# EAGLE design midisync (EAGLE 5.08)
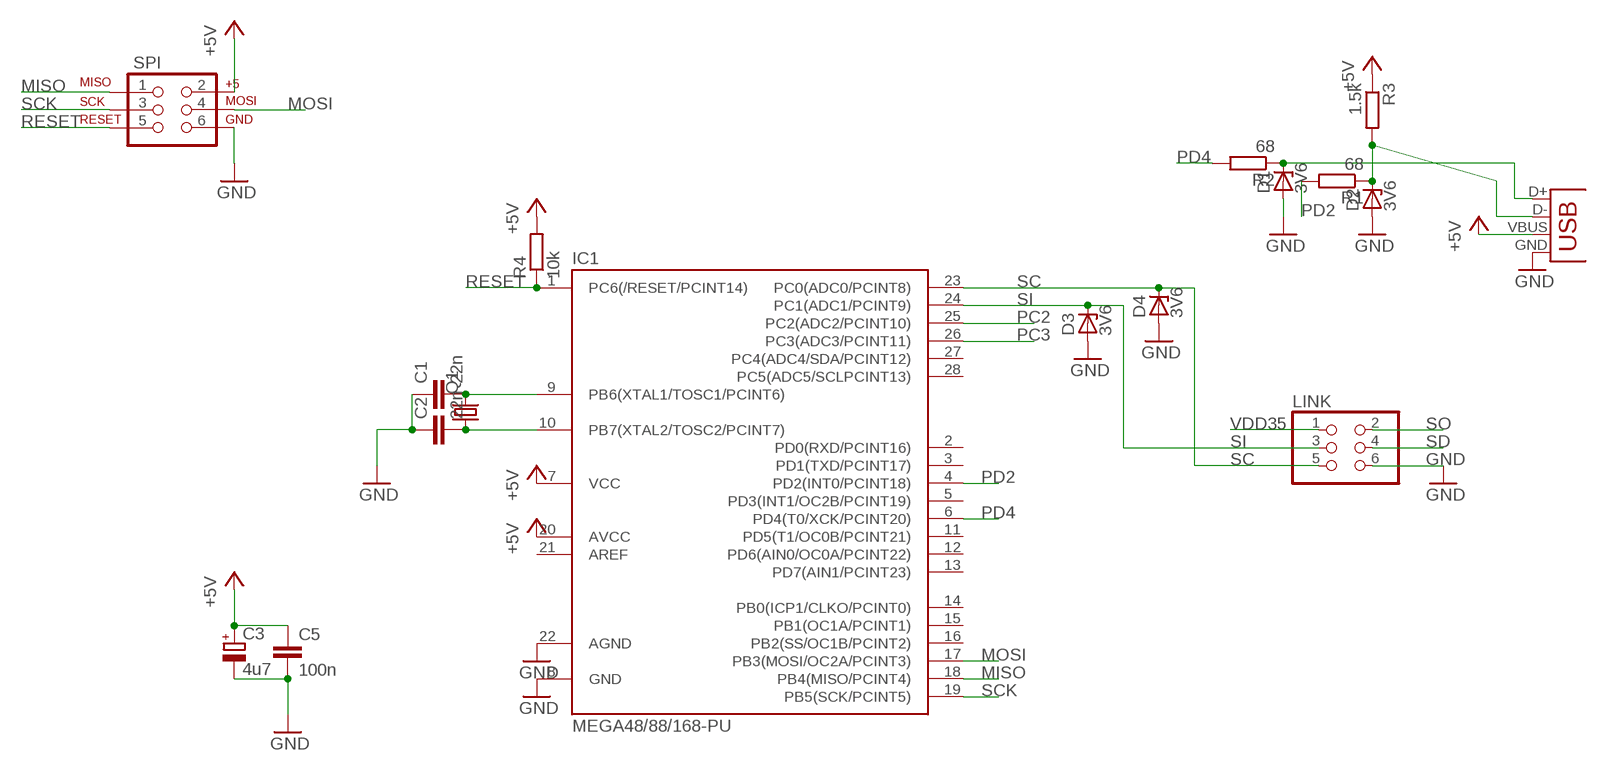
[diagram p0: schematic, sheet 1]

## Parts
C1  22n  C-EU025-025X050  [C025-025X050]
C2  22n  C-EU025-025X050  [C025-025X050]
C3  4u7  CPOL-EUE2.5-5  [E2,5-5]
C5  100n  C-EU050-024X044  [C050-024X044]
D1  3V6  ZENER-DIODEZD-5  [ZDIO-5]
D2  3V6  ZENER-DIODEZD-5  [ZDIO-5]
D3  3V6  ZENER-DIODEZD-5  [ZDIO-5]
D4  3V6  ZENER-DIODEZD-5  [ZDIO-5]
IC1  MEGA48/88/168-PU  [DIL28-3]
LINK  PINHD-2X3  [2X03]
Q1  CRYSTALHC49US  [HC49US]
R1  68  R-EU_0204/5  [0204/5]
R2  68  R-EU_0204/5  [0204/5]
R3  1.5k  R-EU_0204/5  [0204/5]
R4  10k  R-EU_0204/5  [0204/5]
SPI  AVR_SPI_PRG_62X3_LOCK  [2X3_LOCK]
X1  USBPTH  [USB-B-PTH]

## Nets
+5V: C3.+ C5.1 IC1.7(VCC) IC1.20(AVCC) R3.1 R4.2 SPI.2 X1.VBUS
GND: C1.1 C2.1 C3.- C5.2 D1.A D2.A D3.A D4.A IC1.8(GND) IC1.22(AGND) LINK.6 SPI.6 X1.GND
MISO: IC1.18(PB4(MISO/PCINT4)) SPI.1
MOSI: IC1.17(PB3(MOSI/OC2A/PCINT3)) SPI.4
N$1: C1.2 IC1.9(PB6(XTAL1/TOSC1/PCINT6)) Q1.2
N$2: C2.2 IC1.10(PB7(XTAL2/TOSC2/PCINT7)) Q1.1
N$3: D1.C R2.1 X1.D+
N$4: D2.C R1.1 R3.2 X1.D-
PC2: IC1.25(PC2(ADC2/PCINT10))
PC3: IC1.26(PC3(ADC3/PCINT11))
PD2: IC1.4(PD2(INT0/PCINT18)) R1.2
PD4: IC1.6(PD4(T0/XCK/PCINT20)) R2.2
RESET: IC1.1(PC6(/RESET/PCINT14)) R4.1 SPI.5
SC: D4.C IC1.23(PC0(ADC0/PCINT8)) LINK.5
SCK: IC1.19(PB5(SCK/PCINT5)) SPI.3
SD: LINK.4
SI: D3.C IC1.24(PC1(ADC1/PCINT9)) LINK.3
SO: LINK.2
VDD35: LINK.1
Unconnected: IC1.2(PD0(RXD/PCINT16)) IC1.3(PD1(TXD/PCINT17)) IC1.5(PD3(INT1/OC2B/PCINT19)) IC1.11(PD5(T1/OC0B/PCINT21)) IC1.12(PD6(AIN0/OC0A/PCINT22)) IC1.13(PD7(AIN1/PCINT23)) IC1.14(PB0(ICP1/CLKO/PCINT0)) IC1.15(PB1(OC1A/PCINT1)) IC1.16(PB2(SS/OC1B/PCINT2)) IC1.21(AREF) IC1.27(PC4(ADC4/SDA/PCINT12)) IC1.28(PC5(ADC5/SCLPCINT13))

## Library data of the parts
C1 C2 C5 = rcl:C-EU: CAPACITOR, European symbol
C3 = rcl:CPOL-EU: POLARIZED CAPACITOR, European symbol
D1-D4 = diode:ZENER-DIODE: Z-Diode
IC1 = avr-6:MEGA48/88/168-PU
LINK = SparkFun:PINHD-2X3: PIN HEADER
Q1 = SparkFun:CRYSTAL: Crystals Various standard crystals. Proven footprints. Spark Fun Electronics SKU : COM-00534
R1-R4 = rcl:R-EU_: RESISTOR, European symbol
SPI = SparkFun:AVR_SPI_PRG_6: AVR ISP 6 Pin This is the reduced ISP connector for AVR programming. Common on Arduino. This footprint will take up less PCB space and can be used with a 10-pin to 6-pin adapter such as SKU: BOB-08508
X1 = SparkFun:USB: USB Connectors USB-B-PTH is fully proven SKU : PRT-00139 USB-miniB is fully proven SKU : PRT-00587 USB-A-PCB is untested. USB-A-H is throughly reviewed, but untested. Spark Fun Electronics SKU : PRT-00437 USB-B-SMT is throughly reviewed, but untested. Needs silkscreen touching up. USB-A-S has not been used/tested USB-MB-H has not been used/tested

## Board
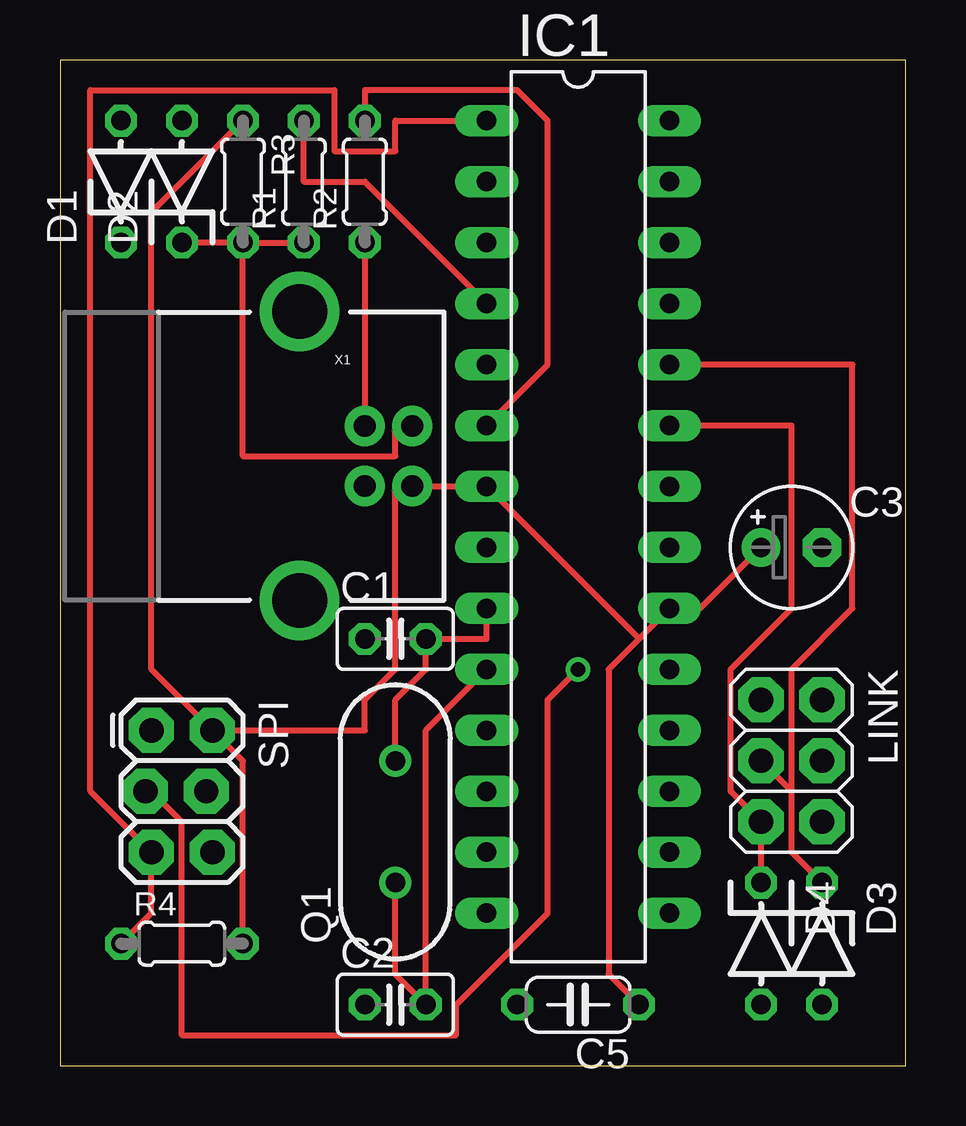
[diagram p1: board, top side]
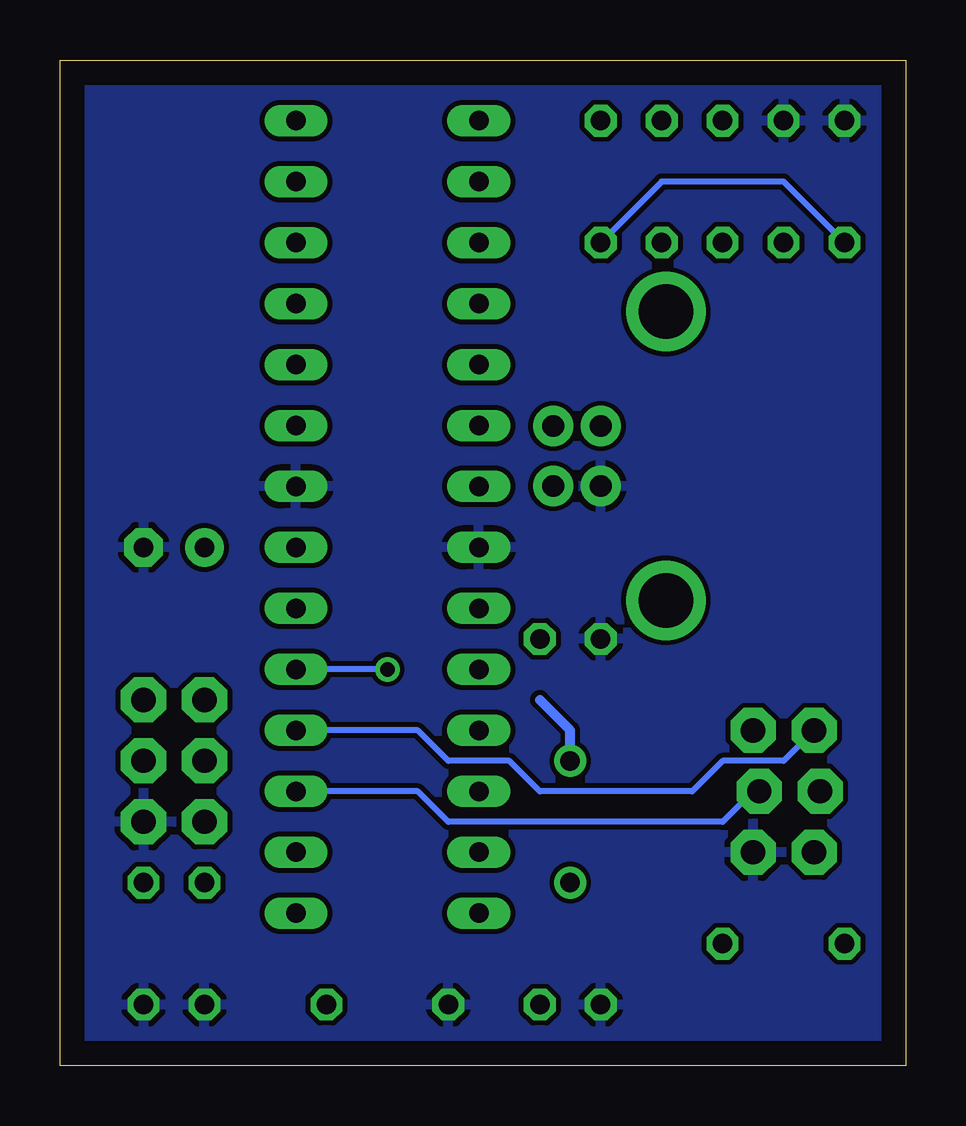
[diagram p2: board, bottom side, seen from below]

Size 35.23 x 41.9 mm. Coordinates in mm from the lower left corner, seen from the top.
Outline: 0,0 35.23,0 35.23,41.9 0,41.9 0,0
Copper layers (1*16): Top 0.035mm / dielectric 1.5mm / Bottom 0.035mm
Design rules "default": minimum track width 10mil, minimum drill 24mil, track to track 8mil, track to pad 8mil, pad to pad 8mil, via to via 8mil, smd to smd 8mil, copper to edge 40mil, drill to drill 8mil, minimum pad ring 10mil, minimum via ring 8mil, stop-mask expansion 4mil, vias tented up to drill 0mil, thermal gap 10mil

### Footprints (pad centres in the part's own frame; a part is rotated, then mirrored left to right if it is on the bottom)
C025-025X050 = drill 0.813 octagon: 1 -1.27,0; 2 1.27,0
E2,5-5 = drill 0.813 pad 1.6 round: + -1.27,0 | drill 0.813 pad 1.6 octagon: - 1.27,0
C050-024X044 = drill 0.813 octagon: 1 -2.54,0; 2 2.54,0
ZDIO-5 = drill 0.813 octagon: A 2.54,0; C -2.54,0
DIL28-3 = drill 0.813 long: 1 -16.51,-3.81; 2 -13.97,-3.81; 3 -11.43,-3.81; 4 -8.89,-3.81; 5 -6.35,-3.81; 6 -3.81,-3.81; 7 -1.27,-3.81; 8 1.27,-3.81; 9 3.81,-3.81; 10 6.35,-3.81; 11 8.89,-3.81; 12 11.43,-3.81; 13 13.97,-3.81; 14 16.51,-3.81; 15 16.51,3.81; 16 13.97,3.81; 17 11.43,3.81; 18 8.89,3.81; 19 6.35,3.81; 20 3.81,3.81; 21 1.27,3.81; 22 -1.27,3.81; 23 -3.81,3.81; 24 -6.35,3.81; 25 -8.89,3.81; 26 -11.43,3.81; 27 -13.97,3.81; 28 -16.51,3.81
2X03 = drill 1.016 pad 1.88 octagon: 1 -2.54,-1.27; 2 -2.54,1.27; 3 0,-1.27; 4 0,1.27; 5 2.54,-1.27; 6 2.54,1.27
HC49US = drill 0.813 round: 1 -2.54,0; 2 2.54,0
0204/5 = drill 0.813 octagon: 1 -2.54,0; 2 2.54,0
2X3_LOCK = drill 1.016 pad 1.88 octagon: 1 0,0; 2 0,2.54; 3 2.54,-0.254; 4 2.54,2.286; 5 5.08,0; 6 5.08,2.54
USB-B-PTH = drill 0.914 pad 1.676 round: D+ 0,1.25; D- 1.981,1.25; GND 0,-1.25; VBUS 1.981,-1.25 | drill 2.286 round: P$1 -2.718,-6.02; P$2 -2.718,6.02

### Placement (x,y rotation side)
C1  13.97,17.78 0 top
C2  13.97,2.54 0 top
C3  30.48,21.59 0 top
C5  21.59,2.54 180 top
D1  2.54,36.83 90 top
D2  5.08,36.83 90 top
D3  31.75,5.08 270 top
D4  29.21,5.08 270 top
IC1  21.59,22.86 270 top
LINK  30.48,12.7 270 top
Q1  13.97,10.16 90 top
R1  10.16,36.83 90 top
R2  12.7,36.83 90 top
R3  7.62,36.83 270 top
R4  5.08,5.08 0 top
SPI  3.81,13.97 270 top
X1  12.7,25.4 0 top

### Tracks (layer width: path | path; a pad name or v marks a point on that pad's centre or on a via)
+5V
  Top 0.254: R4.2 7.62,12.7 SPI.2 | R3.1 3.81,35.56 3.81,16.51 SPI.2 | C5.1 22.86,3.81 22.86,16.51 24.13,17.78 | 24.13,17.78 IC1.20 26.67,19.05 C3.+ | 24.13,17.78 IC1.7 15.24,24.13 X1.VBUS 13.97,24.13 13.97,16.51 12.7,15.24 12.7,13.97 SPI.2
GND
  pour Bottom: 0,41.91 35.56,41.91 35.56,0 0,0
MISO
  Bottom 0.254: IC1.18 20.32,13.97 19.05,12.7 16.51,12.7 15.24,11.43 8.89,11.43 7.62,12.7 5.08,12.7 SPI.1
MOSI
  Bottom 0.254: IC1.17 20.32,11.43 19.05,10.16 7.62,10.16 6.35,11.43 SPI.4
N$1
  Top 0.254: IC1.9 17.78,17.78 C1.2 15.24,16.51 13.97,15.24 Q1.2
  Bottom 0.406: Q1.2 13.97,13.97 15.24,15.24
N$2
  Top 0.254: Q1.1 13.97,3.81 C2.2 15.24,13.97 IC1.10
N$3
  Top 0.254: R2.1 X1.D+
  Bottom 0.254: D1.C 5.08,36.83 10.16,36.83 R2.1
N$4
  Top 0.254: R3.2 D2.C | R3.2 R1.1 | R3.2 7.62,25.4 13.97,25.4 13.97,26.67 X1.D-
PD2
  Top 0.254: IC1.4 12.7,36.83 10.16,36.83 R1.2
PD4
  Top 0.254: IC1.6 20.32,29.21 20.32,39.37 19.05,40.64 12.7,40.64 R2.2
RESET
  Top 0.254: R4.1 3.81,6.35 SPI.5 1.27,11.43 1.27,40.64 11.43,40.64 11.43,38.1 13.97,38.1 13.97,39.37 IC1.1
SC
  Top 0.254: IC1.23 30.48,26.67 30.48,19.05 27.94,16.51 27.94,11.43 LINK.5 D4.C
SCK  (via drill 0.61)
  Top 0.254: v21.59,16.51 20.32,15.24 20.32,6.35 16.51,2.54 16.51,1.27 5.08,1.27 5.08,10.16 3.81,11.43 SPI.3
  Bottom 0.254: v21.59,16.51 IC1.19
SI
  Top 0.254: D3.C 30.48,8.89 30.48,11.43 | 30.48,11.43 LINK.3 | IC1.24 33.02,29.21 33.02,19.05 30.48,16.51 30.48,11.43